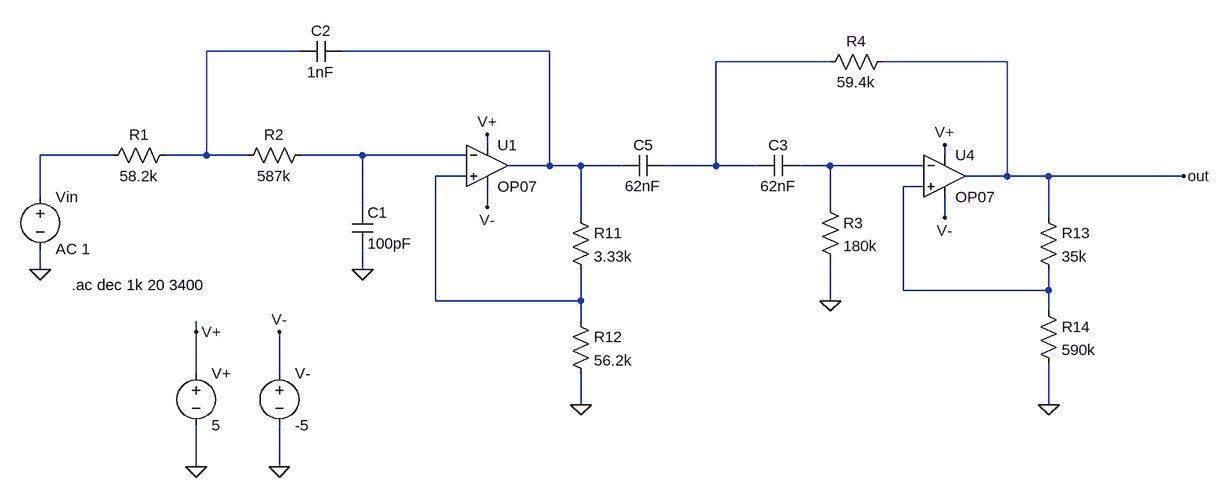
[diagram p0: schematic Working Fourth Order Bandpass.asc]
Working Fourth Order Bandpass.asc, the LTspice schematic file:
Version 4
SHEET 1 2004 680
WIRE 208 0 64 0
WIRE 592 0 272 0
WIRE 1024 16 848 16
WIRE 1296 16 1104 16
WIRE 496 144 496 128
WIRE -80 160 -192 160
WIRE 64 160 64 0
WIRE 64 160 0 160
WIRE 128 160 64 160
WIRE 304 160 208 160
WIRE 464 160 304 160
WIRE 1200 160 1200 144
WIRE 592 176 592 0
WIRE 592 176 528 176
WIRE 640 176 592 176
WIRE 704 176 640 176
WIRE 848 176 848 16
WIRE 848 176 768 176
WIRE 912 176 848 176
WIRE 1024 176 976 176
WIRE 1168 176 1024 176
WIRE 464 192 416 192
WIRE 1296 192 1296 16
WIRE 1296 192 1232 192
WIRE 1360 192 1296 192
WIRE 1568 192 1360 192
WIRE 1168 208 1136 208
WIRE -192 224 -192 160
WIRE 304 240 304 160
WIRE 496 240 496 208
WIRE 1024 240 1024 176
WIRE 640 256 640 176
WIRE 1200 256 1200 224
WIRE 1360 256 1360 192
WIRE -192 336 -192 304
WIRE 304 336 304 304
WIRE 1136 368 1136 208
WIRE 1360 368 1360 336
WIRE 1360 368 1136 368
WIRE 416 384 416 192
WIRE 640 384 640 336
WIRE 640 384 416 384
WIRE 1024 384 1024 320
WIRE 1360 400 1360 368
WIRE 640 416 640 384
WIRE 48 432 48 416
WIRE 48 496 48 432
WIRE 176 496 176 432
WIRE 640 544 640 496
WIRE 1360 544 1360 480
WIRE 48 640 48 576
WIRE 176 640 176 576
FLAG -192 336 0
FLAG 496 128 V+
FLAG 176 640 0
FLAG 48 640 0
FLAG 1200 144 V+
FLAG 1360 544 0
FLAG 640 544 0
FLAG 1568 192 out
FLAG 496 240 V-
FLAG 48 432 V+
FLAG 176 432 V-
FLAG 1200 256 V-
FLAG 304 336 0
FLAG 1024 384 0
SYMBOL res 16 144 R90
WINDOW 0 0 56 VBottom 2
WINDOW 3 32 56 VTop 2
SYMATTR InstName R1
SYMATTR Value 58.2k
SYMBOL cap 272 -16 R90
WINDOW 0 0 32 VBottom 2
WINDOW 3 32 32 VTop 2
SYMATTR InstName C2
SYMATTR Value 1nF
SYMBOL OpAmps\\OP07 496 112 R0
SYMATTR InstName U1
SYMBOL voltage -192 208 R0
WINDOW 123 0 0 Left 0
WINDOW 39 0 0 Left 0
SYMATTR InstName Vin
SYMATTR Value AC 1
SYMBOL voltage 48 480 R0
SYMATTR InstName V+
SYMATTR Value 5
SYMBOL voltage 176 480 R0
SYMATTR InstName V-
SYMATTR Value -5
SYMBOL cap 976 160 R90
WINDOW 0 0 32 VBottom 2
WINDOW 3 32 32 VTop 2
SYMATTR InstName C3
SYMATTR Value 62nF
SYMBOL OpAmps\\OP07 1200 128 R0
SYMATTR InstName U4
SYMBOL res 624 240 R0
SYMATTR InstName R11
SYMATTR Value 3.33k
SYMBOL res 624 400 R0
SYMATTR InstName R12
SYMATTR Value 56.2k
SYMBOL res 1344 240 R0
SYMATTR InstName R13
SYMATTR Value 35k
SYMBOL res 1344 384 R0
SYMATTR InstName R14
SYMATTR Value 590k
SYMBOL res 224 144 R90
WINDOW 0 0 56 VBottom 2
WINDOW 3 32 56 VTop 2
SYMATTR InstName R2
SYMATTR Value 587k
SYMBOL cap 288 240 R0
SYMATTR InstName C1
SYMATTR Value 100pF
SYMBOL cap 768 160 R90
WINDOW 0 0 32 VBottom 2
WINDOW 3 32 32 VTop 2
SYMATTR InstName C5
SYMATTR Value 62nF
SYMBOL res 1008 224 R0
SYMATTR InstName R3
SYMATTR Value 180k
SYMBOL res 1120 0 R90
WINDOW 0 0 56 VBottom 2
WINDOW 3 32 56 VTop 2
SYMATTR InstName R4
SYMATTR Value 59.4k
TEXT -144 360 Left 2 !.ac dec 1k 20 3400

The netlist it stands for:
* Working Fourth Order Bandpass.asc
R1 N001 N004 58.2k
C2 N002 N001 1nF
XU1 N007 N005 V+ V- N002 LT1001  ; OP07, pins In+ In- V+ V- OUT
Vin N004 0 AC 1
V+ V+ 0 5
V- V- 0 -5
C3 N006 N003 62nF
XU4 N008 N006 V+ V- out LT1001  ; OP07, pins In+ In- V+ V- OUT
R11 N002 N007 3.33k
R12 N007 0 56.2k
R13 out N008 35k
R14 N008 0 590k
R2 N005 N001 587k
C1 N005 0 100pF
C5 N003 N002 62nF
R3 N006 0 180k
R4 out N003 59.4k
.ac dec 1k 20 3400
.lib LTC.lib
.backanno
.end